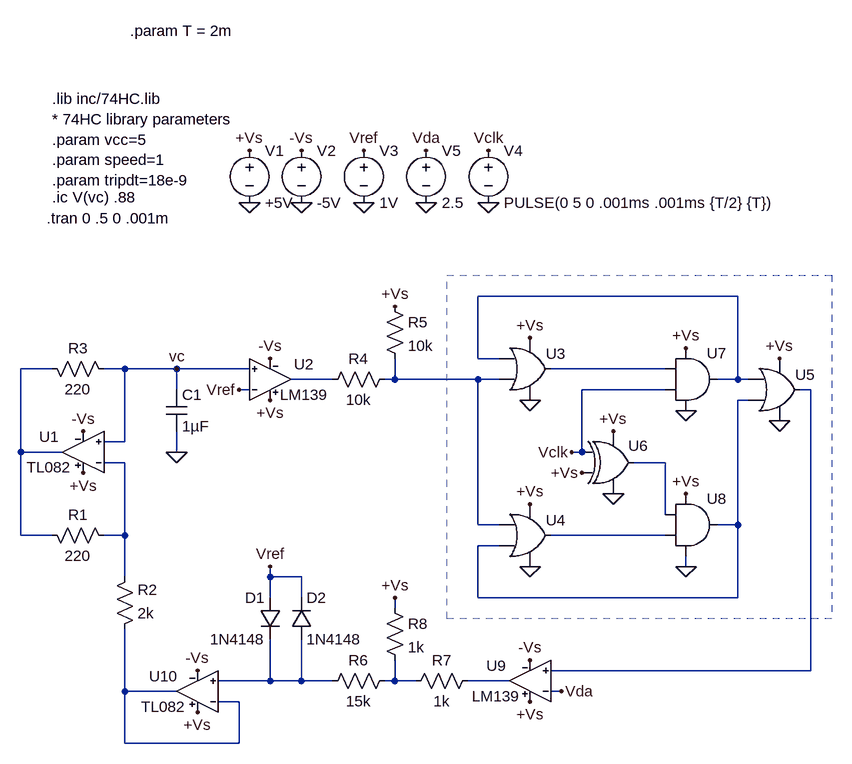
[diagram p0: schematic tentMapCircuitRev2.asc]
tentMapCircuitRev2.asc, the LTspice schematic file:
Version 4
SHEET 1 1284 680
WIRE 768 -368 368 -368
WIRE 368 -272 368 -368
WIRE 400 -272 368 -272
WIRE -288 -256 -336 -256
WIRE -176 -256 -208 -256
WIRE -96 -256 -176 -256
WIRE 16 -256 -96 -256
WIRE 656 -256 480 -256
WIRE 144 -240 80 -240
WIRE 240 -240 240 -272
WIRE 240 -240 224 -240
WIRE 368 -240 240 -240
WIRE 400 -240 368 -240
WIRE 768 -240 768 -368
WIRE 768 -240 736 -240
WIRE 784 -240 768 -240
WIRE -96 -224 -96 -256
WIRE 16 -224 0 -224
WIRE 656 -224 528 -224
WIRE 880 -224 864 -224
WIRE 784 -208 768 -208
WIRE -176 -144 -176 -256
WIRE -176 -144 -208 -144
WIRE -336 -128 -336 -256
WIRE -272 -128 -336 -128
WIRE -96 -128 -96 -160
WIRE 528 -128 528 -224
WIRE 528 -128 512 -128
WIRE -176 -112 -208 -112
WIRE 656 -112 608 -112
WIRE 656 -32 656 -112
WIRE 368 -16 368 -240
WIRE 400 -16 368 -16
WIRE 768 -16 768 -208
WIRE 768 -16 736 -16
WIRE -336 0 -336 -128
WIRE -288 0 -336 0
WIRE -176 0 -176 -112
WIRE -176 0 -208 0
WIRE 656 0 480 0
WIRE 400 16 368 16
WIRE 688 48 688 32
WIRE -176 64 -176 0
WIRE 48 64 48 48
WIRE 96 64 48 64
WIRE 48 96 48 64
WIRE 96 96 96 64
WIRE 368 96 368 16
WIRE 768 96 768 -16
WIRE 768 96 368 96
WIRE 240 112 240 96
WIRE 880 208 880 -224
WIRE 880 208 480 208
WIRE 48 224 48 160
WIRE 48 224 -32 224
WIRE 96 224 96 160
WIRE 96 224 48 224
WIRE 144 224 96 224
WIRE 240 224 240 192
WIRE 240 224 224 224
WIRE 272 224 240 224
WIRE 416 224 352 224
WIRE -176 240 -176 144
WIRE -96 240 -176 240
WIRE 496 240 480 240
WIRE 0 256 -32 256
WIRE -176 320 -176 240
WIRE 0 320 0 256
WIRE 0 320 -176 320
FLAG 96 -512 0
FLAG 16 -512 0
FLAG 96 -592 -Vs
FLAG -240 -160 -Vs
FLAG 16 -592 +Vs
FLAG -240 -96 +Vs
FLAG -96 -128 0
FLAG -96 -256 vc
FLAG 48 -272 -Vs
FLAG 48 -208 +Vs
FLAG 192 -512 0
FLAG 192 -592 Vref
FLAG 0 -224 Vref
FLAG 240 -352 +Vs
FLAG 448 -208 0
FLAG 448 -304 +Vs
FLAG 448 48 0
FLAG 448 -48 +Vs
FLAG 832 -176 0
FLAG 832 -272 +Vs
FLAG 576 -64 0
FLAG 528 -96 +Vs
FLAG 688 -192 0
FLAG 688 -288 +Vs
FLAG 688 48 0
FLAG 688 -64 +Vs
FLAG 576 -160 +Vs
FLAG 384 -512 0
FLAG 384 -592 Vclk
FLAG 512 -128 Vclk
FLAG 448 192 -Vs
FLAG 448 256 +Vs
FLAG 496 240 Vda
FLAG 288 -512 0
FLAG 288 -592 Vda
FLAG 48 48 Vref
FLAG -64 208 -Vs
FLAG -64 272 +Vs
FLAG 240 96 +Vs
SYMBOL TL082 -240 -128 M0
SYMATTR InstName U1
SYMBOL voltage 16 -608 R0
SYMATTR InstName V1
SYMATTR Value +5V
SYMBOL voltage 96 -608 R0
SYMATTR InstName V2
SYMATTR Value -5V
SYMBOL res -304 -16 M90
WINDOW 0 0 56 VBottom 2
WINDOW 3 32 56 VTop 2
SYMATTR InstName R1
SYMATTR Value 220
SYMBOL res -192 160 M180
WINDOW 0 36 76 Left 2
WINDOW 3 36 40 Left 2
SYMATTR InstName R2
SYMATTR Value 2k
SYMBOL res -304 -272 M90
WINDOW 0 0 56 VBottom 2
WINDOW 3 32 56 VTop 2
SYMATTR InstName R3
SYMATTR Value 220
SYMBOL cap -112 -224 R0
SYMATTR InstName C1
SYMATTR Value 1µF
SYMBOL LM139 48 -240 R0
SYMATTR InstName U2
SYMBOL voltage 192 -608 R0
SYMATTR InstName V3
SYMATTR Value 1V
SYMBOL res 240 -256 R90
WINDOW 0 0 56 VBottom 2
WINDOW 3 32 56 VTop 2
SYMATTR InstName R4
SYMATTR Value 10k
SYMBOL res 224 -368 R0
SYMATTR InstName R5
SYMATTR Value 10k
SYMBOL 74HC32 448 -320 R0
WINDOW 0 24 41 Left 2
SYMATTR InstName U3
SYMBOL 74HC32 448 -64 R0
WINDOW 0 24 41 Left 2
SYMATTR InstName U4
SYMBOL 74HC32 832 -288 R0
WINDOW 0 24 41 Left 2
SYMATTR InstName U5
SYMBOL 74HC86 576 -176 R0
WINDOW 0 23 38 Left 2
SYMATTR InstName U6
SYMBOL 74HC08 704 -304 R0
SYMATTR InstName U7
SYMBOL 74HC08 704 -80 R0
SYMATTR InstName U8
SYMBOL voltage 384 -608 R0
WINDOW 123 0 0 Left 0
WINDOW 39 0 0 Left 0
SYMATTR InstName V4
SYMATTR Value PULSE(0 5 0 .001ms .001ms {T/2} {T})
SYMBOL LM139 448 224 M0
SYMATTR InstName U9
SYMBOL voltage 288 -608 R0
SYMATTR InstName V5
SYMATTR Value 2.5
SYMBOL diode 64 96 M0
SYMATTR InstName D1
SYMATTR Value 1N4148
SYMBOL diode 80 160 M180
WINDOW 0 24 64 Left 2
WINDOW 3 24 0 Left 2
SYMATTR InstName D2
SYMATTR Value 1N4148
SYMBOL TL082 -64 240 M0
SYMATTR InstName U10
SYMBOL res 224 96 R0
SYMATTR InstName R8
SYMATTR Value 1k
SYMBOL res 240 208 R90
WINDOW 0 0 56 VBottom 2
WINDOW 3 32 56 VTop 2
SYMATTR InstName R6
SYMATTR Value 15k
SYMBOL res 368 208 R90
WINDOW 0 0 56 VBottom 2
WINDOW 3 32 56 VTop 2
SYMATTR InstName R7
SYMATTR Value 1k
TEXT -288 -520 Left 2 !.ic V(vc) .88
TEXT -296 -488 Left 2 !.tran 0 .5 0 .001m
TEXT -288 -672 Left 2 !.lib inc/74HC.lib
TEXT -288 -640 Left 2 !* 74HC library parameters\n.param vcc=5\n.param speed=1\n.param tripdt=18e-9
TEXT -168 -776 Left 2 !.param T = 2m
RECTANGLE Normal 912 128 320 -400 2

The netlist it stands for:
* tentMapCircuitRev2.asc
XU1 vc N008 +Vs -Vs N002 TL082  ; pins 1 2 3 4 5
V1 +Vs 0 +5V
V2 -Vs 0 -5V
R1 N002 N008 220
R2 N014 N008 2k
R3 N002 vc 220
C1 vc 0 1µF
XU2 vc Vref +Vs -Vs N004 LM139  ; pins 1 2 3 4 5
V3 Vref 0 1V
R4 N005 N004 10k
R5 +Vs N005 10k
XU3 N001 N005 N003 +Vs 0 74HC32  ; pins A B Y VCC VGND
XU4 N005 N007 N010 +Vs 0 74HC32  ; pins A B Y VCC VGND
XU5 N001 N007 N006 +Vs 0 74HC32  ; pins A B Y VCC VGND
XU6 Vclk +Vs N009 +Vs 0 74HC86  ; pins A B Y VCC VGND
XU7 N003 Vclk N001 +Vs 0 74HC08  ; pins A B Y VCC VGND
XU8 N009 N010 N007 +Vs 0 74HC08  ; pins A B Y VCC VGND
V4 Vclk 0 PULSE(0 5 0 .001ms .001ms {T/2} {T})
XU9 N006 Vda +Vs -Vs N013 LM139  ; pins 1 2 3 4 5
V5 Vda 0 2.5
D1 Vref N011 1N4148
D2 N011 Vref 1N4148
XU10 N011 N014 +Vs -Vs N014 TL082  ; pins 1 2 3 4 5
R8 +Vs N012 1k
R6 N012 N011 15k
R7 N013 N012 1k
.model D D
.lib standard.dio
.ic V(vc) .88
.tran 0 .5 0 .001m
.lib inc/74HC.lib
* 74HC library parameters
.param vcc=5
.param speed=1
.param tripdt=18e-9
.param T = 2m
.lib inc/TL082.sp
.lib inc\LM139.sp
.backanno
.end